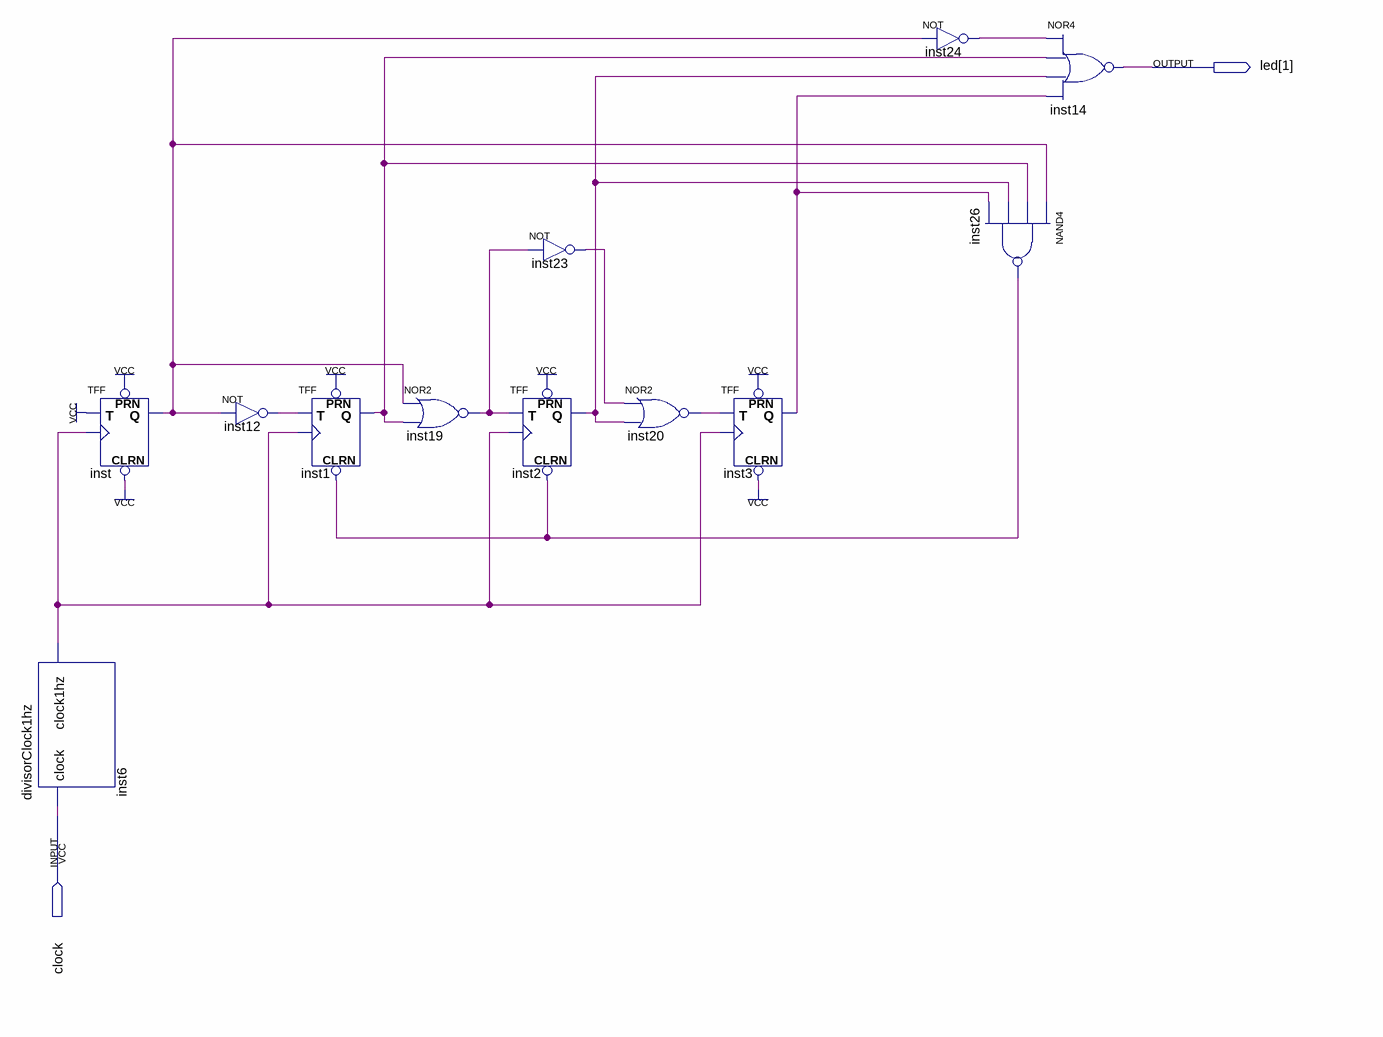
[diagram p0: schematic sheet]
// Quartus schematic contadorMod10.bdf as structural Verilog: 12 symbols, 2 pins
module contadorMod10 (
  input  clock,
  output [1:1] led
);

  wire inst1_q, inst2_q, inst3_q, inst6_clock1hz, inst12_out, inst19_out, inst20_out, inst23_out, inst24_out,
       inst26_out, inst_q;

  TFF inst (.PRN(1'b1), .CLRN(1'b1), .T(1'b1), .CLK(inst6_clock1hz), .Q(inst_q));
  divisorClock1hz inst6 (.clock(clock), .clock1hz(inst6_clock1hz));
  not inst12 (inst12_out, inst_q);
  TFF inst1 (.PRN(1'b1), .CLRN(inst26_out), .T(inst12_out), .CLK(inst6_clock1hz), .Q(inst1_q));
  nor inst19 (inst19_out, inst_q, inst1_q);
  not inst23 (inst23_out, inst19_out);
  TFF inst2 (.PRN(1'b1), .CLRN(inst26_out), .T(inst19_out), .CLK(inst6_clock1hz), .Q(inst2_q));
  nor inst20 (inst20_out, inst23_out, inst2_q);
  TFF inst3 (.PRN(1'b1), .CLRN(1'b1), .T(inst20_out), .CLK(inst6_clock1hz), .Q(inst3_q));
  not inst24 (inst24_out, inst_q);
  nand inst26 (inst26_out, inst_q, inst1_q, inst2_q, inst3_q);
  nor inst14 (led[1], inst24_out, inst1_q, inst2_q, inst3_q);
endmodule
